# EAGLE design Nixie breakout v1.0 (EAGLE 7.5.0)
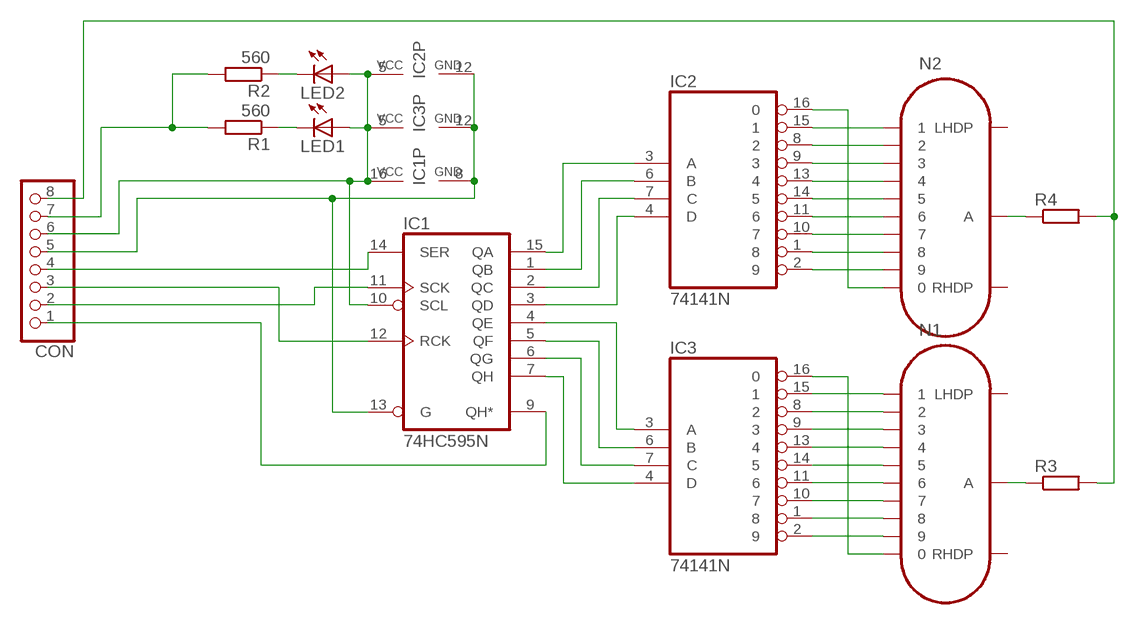
[diagram p0: schematic, sheet 1]

## Parts
CON  PINHD-1X8  [1X08]
IC1  74HC595N  [DIL16]
IC2  74141N  [DIL16]
IC3  74141N  [DIL16]
LED1  LED3MM  [LED3MM]
LED2  LED3MM  [LED3MM]
N1  IN-14  [IN-14]
N2  IN-14  [IN-14]
R1  560  R-EU_0204/7  [0204/7]
R2  560  R-EU_0204/7  [0204/7]
R3  R-EU_0204/7  [0204/7]
R4  R-EU_0204/7  [0204/7]

## Nets
N$1: LED1.K(C) R1.1
N$2: CON.7 R1.2 R2.2
N$3: CON.2 IC1.11(SCK)
N$4: LED2.K(C) R2.1
N$115: IC1.15(QA) IC2.3(A)
N$116: IC1.1(QB) IC2.6(B)
N$117: IC1.2(QC) IC2.7(C)
N$118: IC1.3(QD) IC2.4(D)
N$119: IC1.7(QH) IC3.4(D)
N$120: IC1.6(QG) IC3.7(C)
N$121: IC1.5(QF) IC3.6(B)
N$122: IC1.4(QE) IC3.3(A)
N$123: CON.1 IC1.9(QH*)
N$124: IC2.16 N2.0
N$125: IC2.15 N2.1
N$126: IC2.8 N2.2
N$127: IC2.9 N2.3
N$128: IC2.13 N2.4
N$129: IC2.14 N2.5
N$130: IC2.11 N2.6
N$131: IC2.10 N2.7
N$132: IC2.1 N2.8
N$133: IC2.2 N2.9
N$134: IC3.15 N1.1
N$135: IC3.8 N1.2
N$136: IC3.9 N1.3
N$137: IC3.13 N1.4
N$138: IC3.14 N1.5
N$139: IC3.11 N1.6
N$140: IC3.10 N1.7
N$141: IC3.1 N1.8
N$142: IC3.2 N1.9
N$143: IC3.16 N1.0
N$144: N1.A R3.1
N$145: N2.A R4.1
N$146: CON.8 R3.2 R4.2
N$147: CON.6 IC1.10(SCL) IC1.16(VCC) IC2.5(VCC) IC3.5(VCC) LED1.A LED2.A
N$148: CON.5 IC1.8(GND) IC1.13(G) IC2.12(GND) IC3.12(GND)
N$152: CON.3 IC1.12(RCK)
N$154: CON.4 IC1.14(SER)
Unconnected: N1.LHDP N1.RHDP N2.LHDP N2.RHDP

## Library data of the parts
CON = pinhead:PINHD-1X8: PIN HEADER
IC1 = 74xx-eu:74*595: 8-bit SHIFT REGISTER, output latch
IC2 IC3 = 74xx-eu:74*141: BCD to decimal DECODER/DRIVER
LED1 LED2 = led:LED: LED OSRAM: - CHIPLED LG R971, LG N971, LY N971, LG Q971, LY Q971, LO R971, LY R971 LH N974, LH R974 LS Q976, LO Q976, LY Q976 LO Q996 - Hyper CHIPLED LW Q18S LB Q993, LB Q99A, LB R99A - SideLED LS A670, LO A670, LY A670, LG A670, LP A670 LB A673, LV A673, LT A673, LW A673 LH A674 LY A675 LS A676, LA A676, LO A676, LY A676, LW A676 LS A679, LY A679, LG A679 - Hyper Micro SIDELED® LS Y876, LA Y876, LO Y876, LY Y876 LT Y87S - SmartLED LW L88C, LW L88S LB L89C, LB L89S, LG L890 LS L89K, LO L89K, LY L89K LS L896, LA L896, LO L896, LY L896 - TOPLED LS T670, LO T670, LY T670, LG T670, LP T670 LSG T670, LSP T670, LSY T670, LOP T670, LYG T670 LG T671, LOG T671, LSG T671 LB T673, LV T673, LT T673, LW T673 LH T674 LS T676, LA T676, LO T676, LY T676, LB T676, LH T676, LSB T676, LW T676 LB T67C, LV T67C, LT T67C, LS T67K, LO T67K, LY T67K, LW E67C LS E67B, LA E67B, LO E67B, LY E67B, LB E67C, LV E67C, LT E67C LW T67C LS T679, LY T679, LG T679 LS T770, LO T770, LY T770, LG T770, LP T770 LB T773, LV T773, LT T773, LW T773 LH T774 LS E675, LA E675, LY E675, LS T675 LS T776, LA T776, LO T776, LY T776, LB T776 LHGB T686 LT T68C, LB T68C - Hyper Mini TOPLED® LB M676 - Mini TOPLED Santana® LG M470 LS M47K, LO M47K, LY M47K Source: http://www.osram.convergy.de LUXEON: - LUMILED® LXK2-PW12-R00, LXK2-PW12-S00, LXK2-PW14-U00, LXK2-PW14-V00 LXK2-PM12-R00, LXK2-PM12-S00, LXK2-PM14-U00 LXK2-PE12-Q00, LXK2-PE12-R00, LXK2-PE12-S00, LXK2-PE14-T00, LXK2-PE14-U00 LXK2-PB12-K00, LXK2-PB12-L00, LXK2-PB12-M00, LXK2-PB14-N00, LXK2-PB14-P00, LXK2-PB14-Q00 LXK2-PR12-L00, LXK2-PR12-M00, LXK2-PR14-Q00, LXK2-PR14-R00 LXK2-PD12-Q00, LXK2-PD12-R00, LXK2-PD12-S00 LXK2-PH12-R00, LXK2-PH12-S00 LXK2-PL12-P00, LXK2-PL12-Q00, LXK2-PL12-R00 Source: www.luxeon.com KINGBRIGHT: KA-3528ASYC Source: www.kingbright.com
N1 N2 = russian-nixies:IN-14: IN-14: medium numeric frontview nixie tube
R1-R4 = resistor:R-EU_: RESISTOR, European symbol

## Board
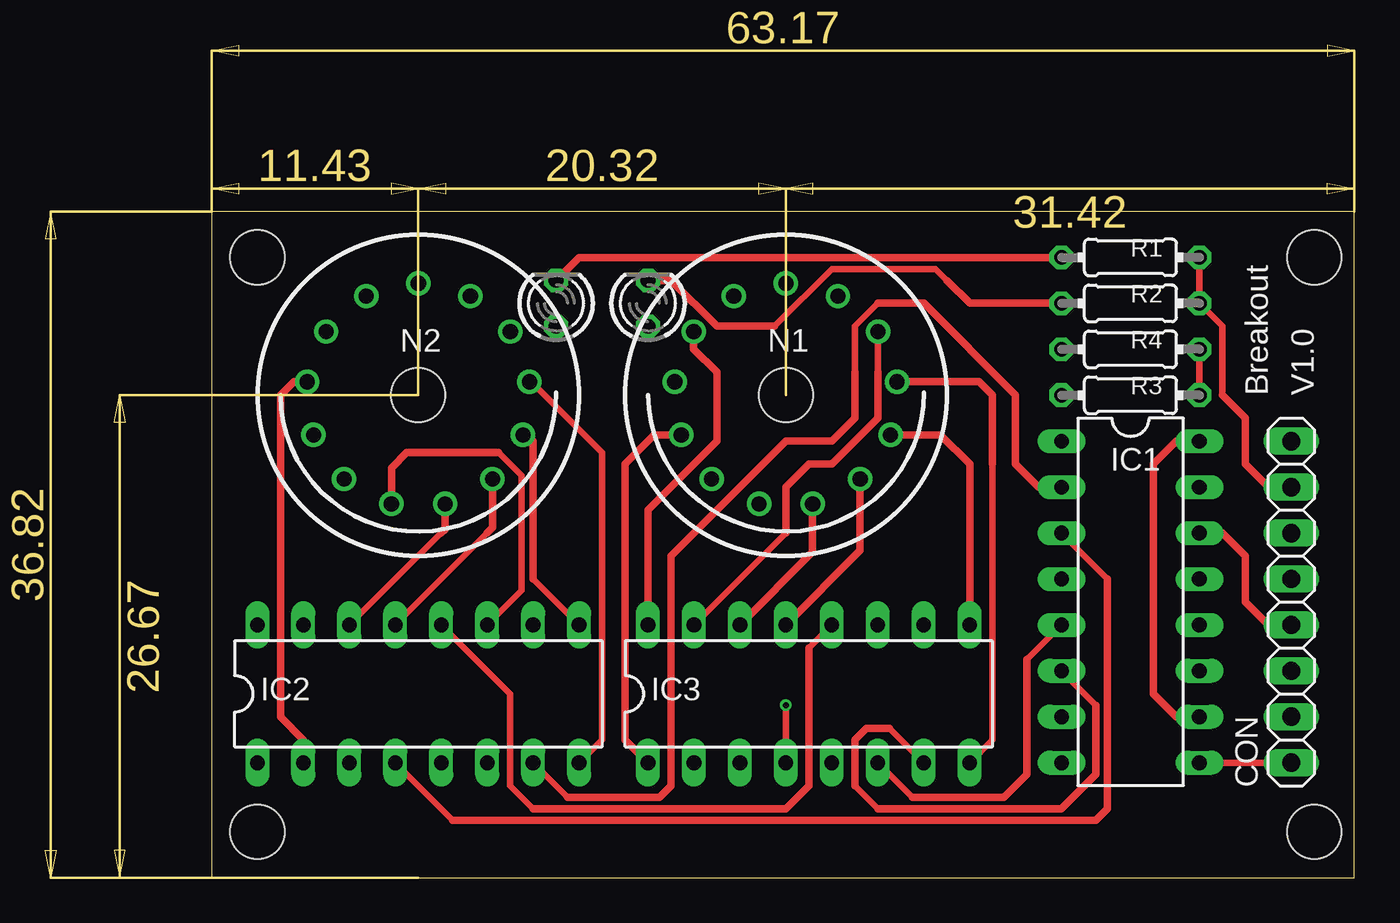
[diagram p1: board, top side]
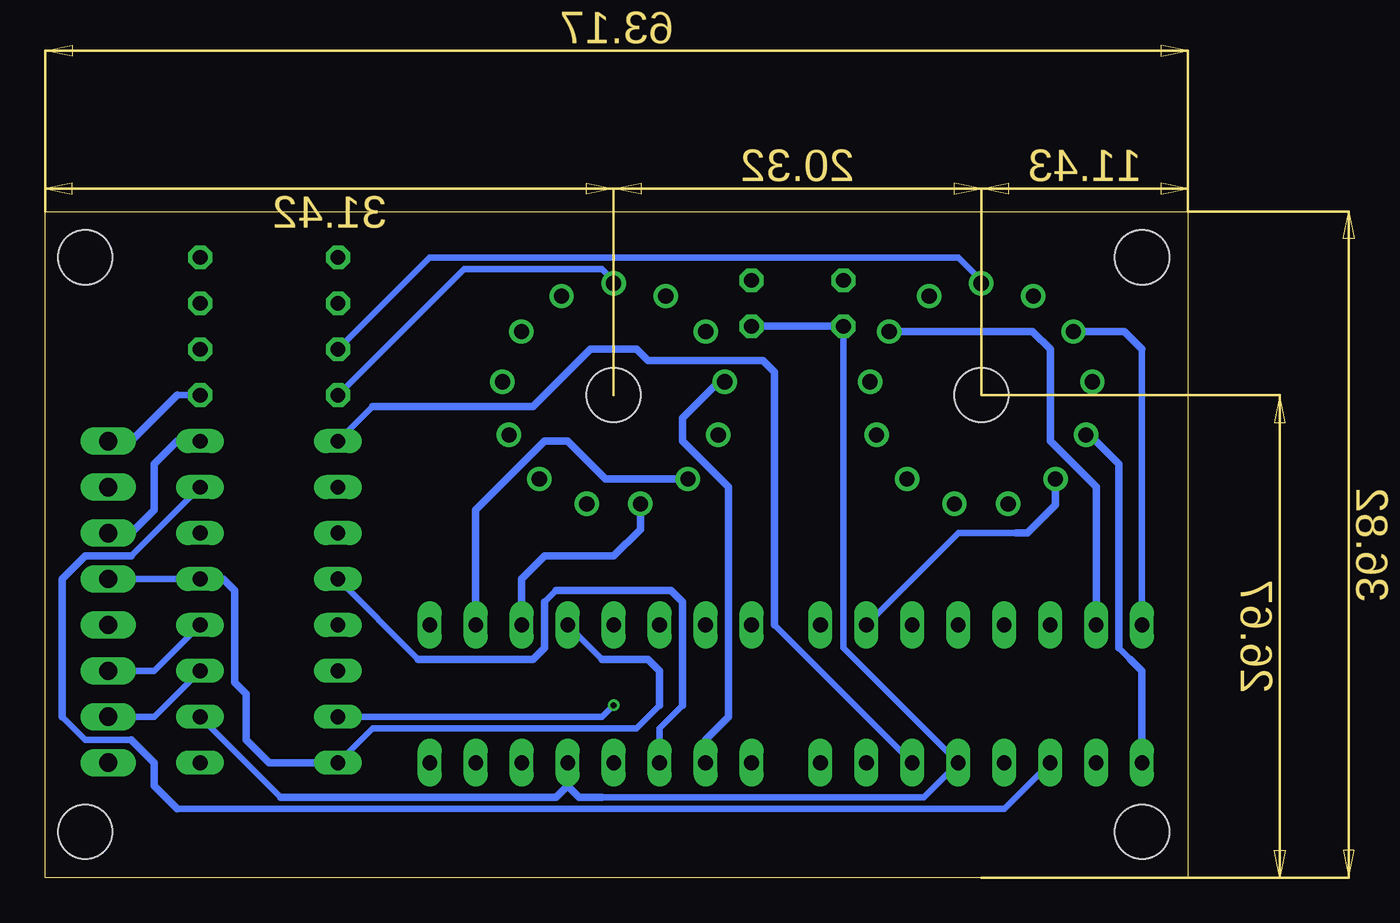
[diagram p2: board, bottom side, seen from below]

Size 63.17 x 36.82 mm. Coordinates in mm from the lower left corner, seen from the top.
Outline: 0,0 63.17,0 63.17,36.82 0,36.82 0,0
Copper layers (1*16): Top 0.035mm / dielectric 1.5mm / Bottom 0.035mm
Design rules "ShenZhen2U EagleRules": minimum track width 7mil, minimum drill 12mil, track to track 7mil, track to pad 7mil, pad to pad 7mil, via to via 7mil, smd to smd 0mil, copper to edge 20mil, drill to drill 10mil, minimum pad ring 10mil, minimum via ring 6mil, stop-mask expansion 2mil, vias tented up to drill 25mil, thermal gap 10mil
Holes 3 mm at 11.43,26.67 31.75,26.67 2.54,34.29 60.96,34.29 2.54,2.54 60.96,2.54

### Footprints (pad centres in the part's own frame; a part is rotated, then mirrored left to right if it is on the bottom)
1X08 = drill 1.016 long: 1 -8.89,0; 2 -6.35,0; 3 -3.81,0; 4 -1.27,0; 5 1.27,0; 6 3.81,0; 7 6.35,0; 8 8.89,0
DIL16 = drill 0.813 long: 1 -8.89,-3.81; 2 -6.35,-3.81; 3 -3.81,-3.81; 4 -1.27,-3.81; 5 1.27,-3.81; 6 3.81,-3.81; 7 6.35,-3.81; 8 8.89,-3.81; 9 8.89,3.81; 10 6.35,3.81; 11 3.81,3.81; 12 1.27,3.81; 13 -1.27,3.81; 14 -3.81,3.81; 15 -6.35,3.81; 16 -8.89,3.81
LED3MM = drill 0.813 octagon: A -1.27,0; K 1.27,0
IN-14 = drill 0.84: 0 5.094,-3.516; 1 -5.094,-3.516; 2 -6.145,-0.746; 3 -5.788,2.195; 4 -4.105,4.633; 5 -1.481,6.01; 6 1.481,6.01; 7 4.105,4.633; 8 5.788,2.195; 9 6.145,-0.746; A 0,-6.19; LHDP 2.877,-5.481; RHDP -2.877,-5.481
0204/7 = drill 0.813 octagon: 1 -3.81,0; 2 3.81,0

### Placement (x,y rotation side)
CON  59.69,15.24 90 top
IC1  50.8,15.24 270 top
IC2  11.43,10.16 0 top
IC3  33.02,10.16 0 top
LED1  19.05,31.75 90 top
LED2  24.13,31.75 90 top
N1  31.75,26.67 180 top
N2  11.43,26.67 180 top
R1  50.8,34.29 0 top
R2  50.8,31.75 0 top
R3  50.8,26.67 0 top
R4  50.8,29.21 0 top

### Tracks (layer width: path | path; a pad name or v marks a point on that pad's centre or on a via)
N$1
  Top 0.406: R1.1 20.32,34.29 LED1.K
N$2
  Top 0.356: R1.2 R2.2 55.88,30.48 55.88,26.67
  Top 0.406: CON.7 58.42,21.59 57.15,22.86 57.15,25.4 55.88,26.67
N$3
  Bottom 0.356: IC1.11 57.15,8.89 CON.2
N$4
  Top 0.356: 40.64,33.02 40.01,33.66 34.29,33.66 31.12,30.48
  Top 0.406: LED2.K 25.4,33.02 27.94,30.48 31.12,30.48 | R2.1 41.91,31.75 40.64,33.02
N$115
  Bottom 0.356: IC2.3 10.16,3.81 55.88,3.81 | 58.42,7.62 60.96,7.62 62.23,8.89 | IC1.15 58.42,17.78
  Bottom 0.406: 58.42,17.78 60.96,17.78 62.23,16.51 62.23,8.89 | 58.42,7.62 57.15,6.35 57.15,5.08 55.88,3.81
N$116
  Bottom 0.356: 22.86,13.97 IC2.6 | IC1.1 45.09,26.04
  Bottom 0.406: 22.86,13.97 22.86,27.94 23.5,28.57 29.84,28.57 30.48,29.21 33.02,29.21 36.2,26.04 45.09,26.04
N$117
  Top 0.356: 19.69,4.45 IC2.7 | 35.56,27.94 35.56,30.48 36.83,31.75
  Top 0.406: 19.69,4.45 24.77,4.45 25.4,5.08 25.4,17.78 31.75,24.13 34.29,24.13 35.56,25.4 35.56,27.94 | 36.83,31.75 39.37,31.75 44.45,26.67 44.45,22.86 45.72,21.59 IC1.2
N$118
  Top 0.356: 13.34,3.17 IC2.4 | IC1.3 49.53,16.51
  Top 0.406: 13.34,3.17 48.9,3.17 49.53,3.81 49.53,16.51
N$119  (via drill 0.33)
  Top 0.356: v31.75,9.53 IC3.4
  Bottom 0.356: v31.75,9.53 32.38,8.89 IC1.7
N$120
  Top 0.356: 37.47,8.25 IC3.7 | 36.83,3.81 35.56,5.08 | IC1.6 48.9,9.53
  Top 0.406: 35.56,5.08 35.56,7.62 36.2,8.25 37.47,8.25 | 36.83,3.81 46.99,3.81 48.9,5.71 48.9,9.53
N$121
  Top 0.356: 38.73,4.45 IC3.6 | IC1.5 45.09,12.07
  Top 0.406: 38.73,4.45 43.81,4.45 45.09,5.71 45.09,12.07
N$122
  Bottom 0.356: IC3.3 29.21,8.25 27.94,9.53 | 35.56,15.24 34.93,15.88 | IC1.4 42.55,12.07
  Bottom 0.406: 34.93,15.88 28.57,15.88 27.94,15.24 27.94,9.53 | 42.55,12.07 36.2,12.07 35.56,12.7 35.56,15.24
N$123
  Top 0.356: CON.1 IC1.9
N$124
  Bottom 0.356: 2.54,29.21 IC2.16
  Bottom 0.406: N2.0 3.52,30.19 2.54,29.21
N$125
  Bottom 0.406: IC2.15 5.08,21.59 7.62,24.13 7.62,29.21 8.6,30.19 N2.1
N$126
  Top 0.356: IC2.8 21.59,7.62 21.59,23.49 17.78,27.3
  Top 0.406: 17.78,27.3 17.69,27.3 N2.2
N$127
  Top 0.356: 17.78,16.51 IC2.9
  Top 0.406: N2.3 17.44,24.47 17.78,24.13 17.78,16.51
N$128
  Top 0.356: 15.24,19.05 IC2.13
  Top 0.406: N2.4 15.54,19.34 15.24,19.05
N$129
  Top 0.356: 12.7,19.05 IC2.14
  Top 0.406: N2.5 12.91,19.26 12.7,19.05
N$130
  Top 0.356: IC2.11 17.14,15.88 17.14,22.22 15.88,23.49
  Top 0.406: 15.88,23.49 10.8,23.49 9.95,22.65 N2.6
N$131
  Bottom 0.356: IC2.10 12.7,19.05 9.52,19.05
  Bottom 0.406: N2.7 7.33,20.61 8.89,19.05 9.52,19.05
N$132
  Bottom 0.356: 3.81,12.7 3.17,12.07
  Bottom 0.406: IC2.1 2.54,11.43 3.17,12.07 | N2.8 5.42,24.47 3.81,22.86 3.81,12.7
N$133
  Top 0.406: N2.9 4.56,27.42 3.81,26.67 3.81,8.89 5.08,7.62 IC2.2
N$134
  Top 0.356: 31.75,19.05 IC3.15 | 36.83,27.94 36.83,29.84 N1.1
  Top 0.406: 36.83,27.94 36.83,25.4 34.29,22.86 33.02,22.86 31.75,21.59 31.75,19.05
N$135
  Top 0.356: IC3.8 43.18,7.62 43.18,22.86
  Top 0.406: N1.2 42.43,27.42 43.18,26.67 43.18,22.86
N$136
  Top 0.406: N1.3 40.3,24.47 41.91,22.86 IC3.9
N$137
  Top 0.406: N1.4 35.86,18.07 IC3.13
N$138
  Top 0.406: N1.5 33.23,17.99 IC3.14
N$139
  Bottom 0.406: N1.6 30.27,19.26 31.75,17.78 35.56,17.78 36.83,16.51 IC3.11
N$140
  Bottom 0.406: N1.7 32.2,22.04 34.29,24.13 35.56,24.13 39.37,20.32 IC3.10
N$141
  Top 0.406: N1.8 24.48,24.47 22.86,22.86 22.86,7.62 IC3.1
N$142
  Bottom 0.406: N1.9 25.92,27.42 27.94,25.4 27.94,24.13 25.4,21.59 25.4,8.89 26.67,7.62 IC3.2
N$143
  Top 0.406: N1.0 26.66,29.22 27.94,27.94 27.94,24.13 24.13,20.32 IC3.16
N$144
  Bottom 0.356: R3.1 40.01,33.66 32.38,33.66 31.75,33.02 N1.A
N$145
  Bottom 0.356: R4.1 41.91,34.29 12.7,34.29 11.43,33.02 N2.A
N$146
  Top 0.356: R4.2 R3.2
  Bottom 0.356: R3.2 55.88,26.67
  Bottom 0.406: CON.8 58.42,24.13 55.88,26.67
N$147
  Top 0.406: IC1.16 53.34,24.13 52.07,22.86 52.07,10.16 53.34,8.89 IC1.10
  Bottom 0.356: 32.38,4.45 14.61,4.45 IC2.5 19.05,12.7 LED1.A | 50.16,4.45 IC1.10
  Bottom 0.406: 32.38,4.45 33.66,4.45 34.29,5.08 | 34.29,5.08 IC3.5 | 50.16,4.45 34.93,4.45 34.29,5.08 | LED2.A LED1.A | IC1.16 55.88,24.13 57.15,22.86 57.15,20.32 58.42,19.05 CON.6
N$148
  Top 0.356: IC2.12 16.51,10.16 16.51,5.08 17.78,3.81 | IC3.12 33.02,12.7
  Top 0.406: 17.78,3.81 31.75,3.81 33.02,5.08 33.02,12.7
  Bottom 0.356: IC1.13 CON.5 | IC1.8 45.09,8.25 30.48,8.25 29.21,9.53 | IC3.12 32.38,12.07
  Bottom 0.406: 32.38,12.07 29.84,12.07 29.21,11.43 29.21,9.53 | IC1.13 53.34,16.51 52.7,15.88 52.7,10.8 52.07,10.16 52.07,7.62 50.8,6.35 IC1.8
N$152
  Bottom 0.356: IC1.12 57.15,11.43 CON.3
N$154
  Top 0.356: CON.4 58.42,13.97
  Top 0.406: 58.42,13.97 57.15,15.24 57.15,17.78 55.88,19.05 IC1.14

### Text on the board
_tsilk: Breakout | V1.0